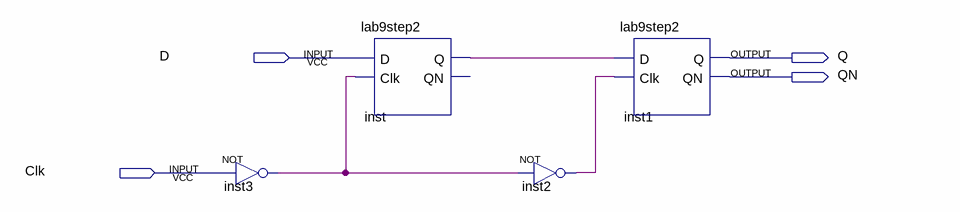
[diagram p0: schematic sheet]
// Quartus schematic lab9step2b.bdf as structural Verilog: 4 symbols, 4 pins
module lab9step2b (
  input  D,
  input  Clk,
  output Q,
  output QN
);

  wire inst2_out, inst3_out, inst_q;

  not inst3 (inst3_out, Clk);
  lab9step2 inst (.D(D), .Clk(inst3_out), .Q(inst_q));  // open: QN
  not inst2 (inst2_out, inst3_out);
  lab9step2 inst1 (.D(inst_q), .Clk(inst2_out), .Q(Q), .QN(QN));
endmodule
